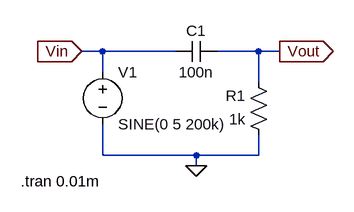
[diagram p0: schematic ex3_1.2.asc]
ex3_1.2.asc, the LTspice schematic file:
Version 4
SHEET 1 880 680
WIRE 0 32 -32 32
WIRE 112 32 0 32
WIRE 240 32 176 32
WIRE 272 32 240 32
WIRE 0 64 0 32
WIRE 240 80 240 32
WIRE 0 192 0 144
WIRE 144 192 0 192
WIRE 240 192 240 160
WIRE 240 192 144 192
WIRE 144 208 144 192
FLAG 144 208 0
FLAG -32 32 Vin
IOPIN -32 32 In
FLAG 272 32 Vout
IOPIN 272 32 Out
SYMBOL voltage 0 48 R0
WINDOW 123 0 0 Left 0
WINDOW 39 0 0 Left 0
SYMATTR InstName V1
SYMATTR Value SINE(0 5 200k)
SYMBOL cap 176 16 R90
WINDOW 0 0 32 VBottom 2
WINDOW 3 32 32 VTop 2
SYMATTR InstName C1
SYMATTR Value 100n
SYMBOL res 256 176 R180
WINDOW 0 36 76 Left 2
WINDOW 3 36 40 Left 2
SYMATTR InstName R1
SYMATTR Value 1k
TEXT -126 232 Left 2 !.tran 0.01m

The netlist it stands for:
* ex3_1.2.asc
V1 Vin 0 SINE(0 5 200k)
C1 Vout Vin 100n
R1 0 Vout 1k
.tran 0.01m
.backanno
.end

* Results of the author's LTspice run, read from the files saved beside the schematic
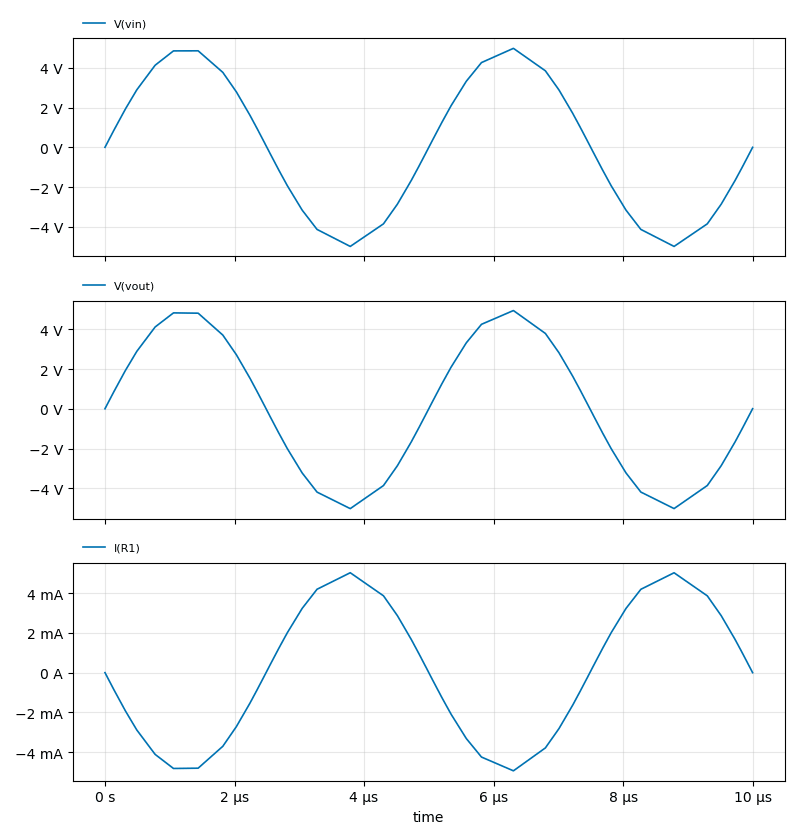
[diagram p1: Transient Analysis of ex3_1.2.asc, plotted from the saved traces]
* Transient Analysis, 1 run:
*   V(vin): min -4.99 V, max 4.983 V, average 10.13 mV, rms 3.475 V, last 0 V
*   V(vout): min -5.025 V, max 4.942 V, average -27.73 mV, rms 3.475 V, last 3.786 mV
*   I(R1): min -4.942 mA, max 5.025 mA, average 27.73 µA, rms 3.475 mA, last -3.786 µA